# Altium project PCB_Project803.PrjPcb (part 2 of 2)

## Sheet Cpu.SchDoc
size A4; SheetNumber: 7; SheetTotal: 7
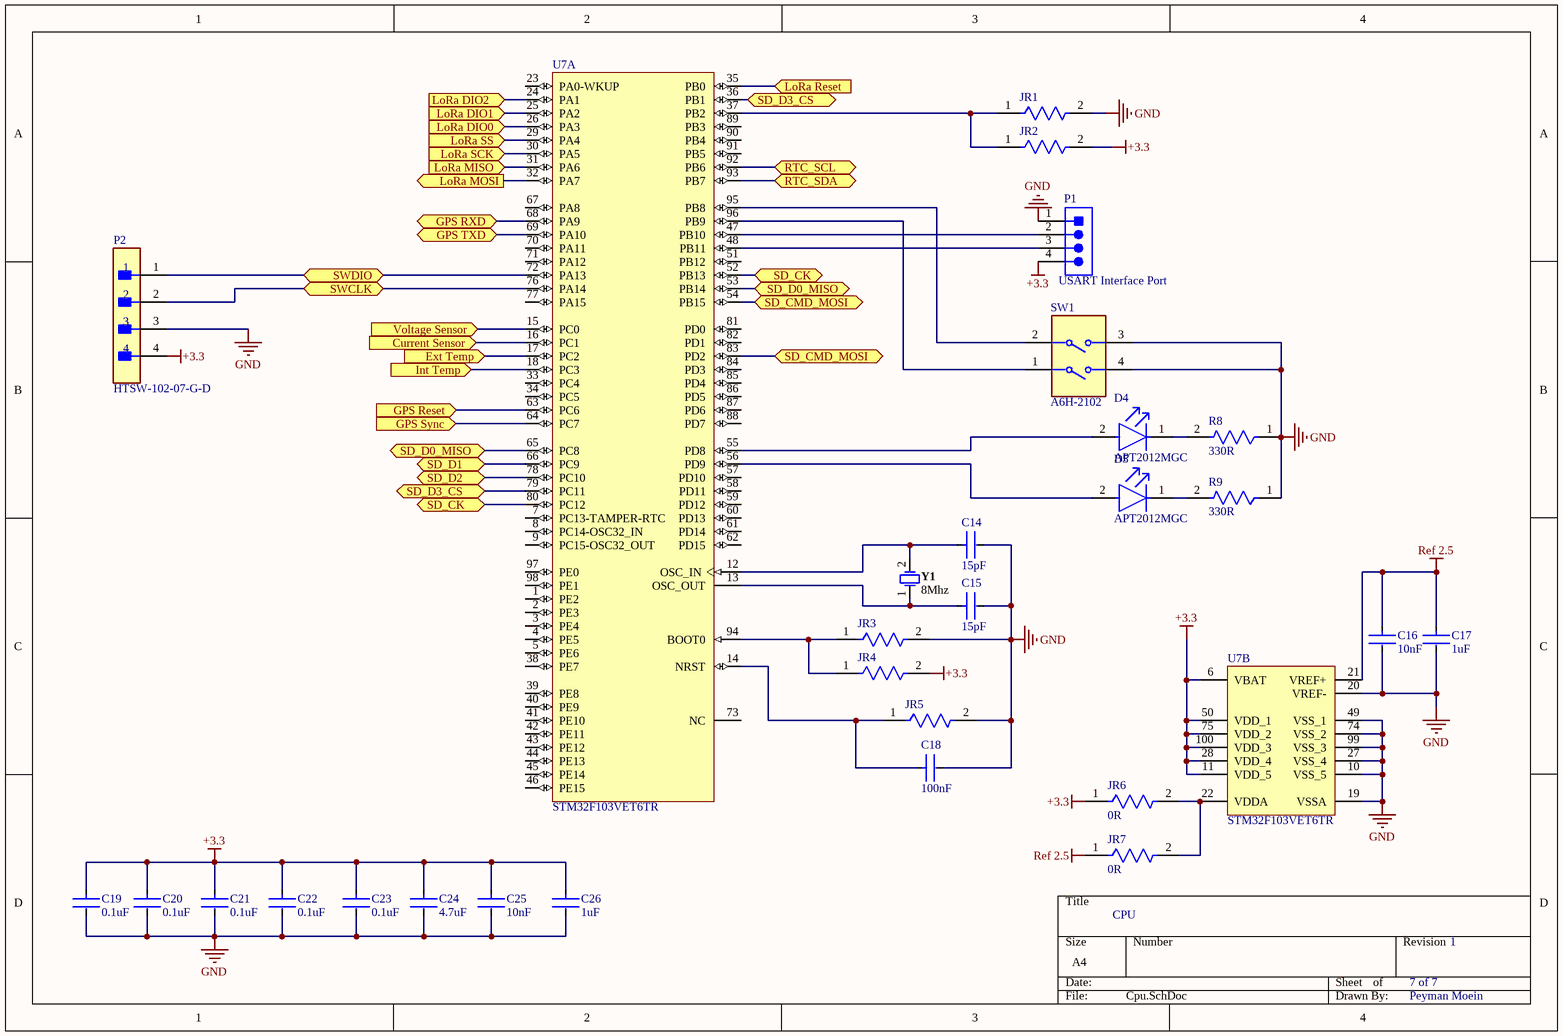
[diagram p6: Cpu.SchDoc]

### Parts
C14  15pF  [FP-C0805C-DN-MFG]
C15  15pF  [FP-C0805C-DN-MFG]
C16  10nF  [FP-C0805C-DN-MFG]
C17  1uF  [FP-C0805C-DN-MFG]
C18  100nF  [FP-C0805C-DN-MFG]
C19  0.1uF  [FP-C0805C-DN-MFG]
C20  0.1uF  [FP-C0805C-DN-MFG]
C21  0.1uF  [FP-C0805C-DN-MFG]
C22  0.1uF  [FP-C0805C-DN-MFG]
C23  0.1uF  [FP-C0805C-DN-MFG]
C24  4.7uF  [FP-C0805C-DN-MFG]
C25  10nF  [FP-C0805C-DN-MFG]
C26  1uF  [FP-C0805C-DN-MFG]
D4  APT2012MGC  [FP-APT2012MGC-MFG]
D5  APT2012MGC  [FP-APT2012MGC-MFG]
JR1  0R  [FP-RMCF0805-MFG]  (value not drawn)
JR2  0R  [FP-RMCF0805-MFG]  (value not drawn)
JR3  0R  [FP-RMCF0805-MFG]  (value not drawn)
JR4  0R  [FP-RMCF0805-MFG]  (value not drawn)
JR5  NC  [FP-RMCF0805-MFG]  (value not drawn)
JR6  0R  [FP-RMCF0805-MFG]
JR7  0R  [FP-RMCF0805-MFG]
P1  USART Interface Port  [JST-S4B-XH-A(LF)(SN)_V]
P2  HTSW-102-07-G-D  [FP-HTSW-102-07-G-D-MFG]
R8  330R  [FP-CRCW0805-e3-MFG]
R9  330R  [FP-CRCW0805-e3-MFG]
SW1  A6H-2102  [FP-A6H-2102-MFG]
U7  STM32F103VET6TR  [STM-LQFP100_L]  (parts A,B of 2)
Y1  8Mhz  [FOX-FOXSLF080-20]

### Ports
Current Sensor (in), Ext Temp (in), GPS Reset (in), GPS RXD (bidir), GPS Sync (in), GPS TXD (bidir), Int Temp (in), LoRa DIO0 (in), LoRa DIO1 (in), LoRa DIO2 (in), LoRa MISO (in), LoRa MOSI (out), LoRa Reset (in), LoRa SCK (in), LoRa SS (in), RTC_SCL (bidir), RTC_SDA (bidir), SD_CK (bidir), SD_CMD_MOSI (bidir), SD_D0_MISO (bidir), SD_D1 (bidir), SD_D2 (bidir), SD_D3_CS (bidir), SWCLK (bidir), SWDIO (bidir), Voltage Sensor (in)

### Nets
+3.3: C19.1 C20.1 C21.1 C22.1 C23.1 C24.1 C25.1 C26.1 JR2.2 JR4.2 JR6.1 P1.4 P2.4 U7.6(VBAT) U7.11(VDD_5) U7.28(VDD_4) U7.50(VDD_1) U7.75(VDD_2) U7.100(VDD_3)
GND: C14.2 C15.2 C16.2 C17.2 C18.2 C19.2 C20.2 C21.2 C22.2 C23.2 C24.2 C25.2 C26.2 JR1.2 JR3.2 JR5.2 P1.1 P2.3 R8.1 R9.1 SW1.3 SW1.4 U7.10(VSS_5) U7.19(VSSA) U7.20(VREF-) U7.27(VSS_4) U7.49(VSS_1) U7.74(VSS_2) U7.99(VSS_3)
Ref 2.5: C16.1 C17.1 JR7.1 U7.21(VREF+)
NetC10_2: U7.16(PC1) ; port Current Sensor
NetC14_1: C14.1 U7.12(OSC_IN) Y1.2
NetC15_1: C15.1 U7.13(OSC_OUT) Y1.1
NetC18_1: C18.1 JR5.1 U7.14(NRST)
NetD4_1: D4.1(C) R8.2
NetD4_2: D4.2(A) U7.55(PD8)
NetD5_1: D5.1(C) R9.2
NetD5_2: D5.2(A) U7.56(PD9)
NetJR1_1: JR1.1 JR2.1 U7.37(PB2)
NetJR3_1: JR3.1 JR4.1 U7.94(BOOT0)
NetJR6_2: JR6.2 JR7.2 U7.22(VDDA)
NetMD1_2: U7.31(PA6) ; port LoRa MISO
NetMD1_3: U7.32(PA7) ; port LoRa MOSI
NetMD1_4: U7.30(PA5) ; port LoRa SCK
NetMD1_5: U7.29(PA4) ; port LoRa SS
NetMD1_6: U7.35(PB0) ; port LoRa Reset
NetMD1_14: U7.26(PA3) ; port LoRa DIO0
NetMD1_15: U7.25(PA2) ; port LoRa DIO1
NetMD1_16: U7.24(PA1) ; port LoRa DIO2
NetP1_2: P1.2 U7.47(PB10)
NetP1_3: P1.3 U7.48(PB11)
NetP2_1: P2.1 U7.72(PA13) ; port SWDIO
NetP2_2: P2.2 U7.76(PA14) ; port SWCLK
NetP_Temp_3: U7.17(PC2) ; port Ext Temp
NetR11_1: U7.92(PB6) ; port RTC_SCL
NetR12_1: U7.93(PB7) ; port RTC_SDA
NetR13_2: U7.78(PC10) ; port SD_D2
NetR14_2: U7.36(PB1) U7.79(PC11) ; port SD_D3_CS
NetR15_2: U7.54(PB15) U7.83(PD2) ; port SD_CMD_MOSI
NetR16_2: U7.52(PB13) U7.80(PC12) ; port SD_CK
NetR17_2: U7.53(PB14) U7.65(PC8) ; port SD_D0_MISO
NetR18_2: U7.66(PC9) ; port SD_D1
NetSW1_1: SW1.1 U7.96(PB9)
NetSW1_2: SW1.2 U7.95(PB8)
NetU4_6: U7.15(PC0) ; port Voltage Sensor
NetU6_2: U7.18(PC3) ; port Int Temp
NetU7_63: U7.63(PC6) ; port GPS Reset
NetU7_64: U7.64(PC7) ; port GPS Sync
NetU7_68: U7.68(PA9) ; port GPS RXD
NetU7_69: U7.69(PA10) ; port GPS TXD

Not connected (* = marked no-connect by the designer): U7 1(PE2) 2(PE3) 3(PE4) 4(PE5) 5(PE6) 7(PC13-TAMPER-RTC) 8(PC14-OSC32_IN) 9(PC15-OSC32_OUT) 23(PA0-WKUP) 33(PC4) 34(PC5) 38(PE7) 39(PE8) 40(PE9) 41(PE10) 42(PE11) 43(PE12) 44(PE13) 45(PE14) 46(PE15) 51(PB12) 57(PD10) 58(PD11) 59(PD12) 60(PD13) 61(PD14) 62(PD15) 67(PA8) 70(PA11) 71(PA12) 73(NC) 77(PA15) 81(PD0) 82(PD1) 84(PD3) 85(PD4) 86(PD5) 87(PD6) 88(PD7) 89(PB3) 90(PB4) 91(PB5) 97(PE0) 98(PE1)

### Notes on the sheet
- CPU
- 7 of 7
- 1
- Peyman Moein

### Library data of the parts
C14 C15 = CMP-2007-00279-2: C396747; Manufacturer Part Number: C0805C104K5RACTU; Manufacturer: KEMET; Voltage Rating: 50 V; Value: 0.10 μF; Tolerance: 0.1; Temperature Characteristic: X7R; Temperature Coefficient: 30ppm/°C; Material: Ceramic; Device Class L2: Capacitors; Temperature Range Low: -55°C; Digikey Description: CAP CER 0.1UF 50V X7R 0805; Category: Cap; ComponentLink2Description: Datasheet; Octopart: https://octopart.com/c0805c104k5ractu-kemet-143926; RoHS: TRUE; ComponentLink2URL: https://content.kemet.com/datasheets/KEM_C1003_C0G_SMD.pdf; Temperature: -55°C to +125°C; Height: 0.88mm; Temperature Range High: +125°C; Device Class L1: Passive Components; Automotive: No; Lead Free: Yes; Ipc Land Pattern Name: CAPC200125X78; Device Class L3: Ceramic Capacitors; Mouser Description: Cap Ceramic 0.1uF 50V X7R 10% SMD 2.0 x 1.2 mm 125 C Paper T/R; Capacitance: 0.10 μF; Package: C0805C-DN
C16 C25 = CMP-2007-00279-2: C188188; Manufacturer Part Number: C0805C104K5RACTU; Manufacturer: KEMET; Voltage Rating: 50 V; Value: 0.10 μF; Tolerance: 0.1; Temperature Characteristic: X7R; Temperature Coefficient: 30ppm/°C; Material: Ceramic; Device Class L2: Capacitors; Temperature Range Low: -55°C; Digikey Description: CAP CER 0.1UF 50V X7R 0805; Category: Cap; ComponentLink2Description: Datasheet; Octopart: https://octopart.com/c0805c104k5ractu-kemet-143926; RoHS: TRUE; ComponentLink2URL: https://content.kemet.com/datasheets/KEM_C1003_C0G_SMD.pdf; Temperature: -55°C to +125°C; Height: 0.88mm; Temperature Range High: +125°C; Device Class L1: Passive Components; Automotive: No; Lead Free: Yes; Ipc Land Pattern Name: CAPC200125X78; Device Class L3: Ceramic Capacitors; Mouser Description: Cap Ceramic 0.1uF 50V X7R 10% SMD 2.0 x 1.2 mm 125 C Paper T/R; Capacitance: 0.10 μF; Package: C0805C-DN
C17 C26 = CMP-2007-00279-2: C89190; Manufacturer Part Number: C0805C104K5RACTU; Manufacturer: KEMET; Voltage Rating: 50 V; Value: 0.10 μF; Tolerance: 0.1; Temperature Characteristic: X7R; Temperature Coefficient: 30ppm/°C; Material: Ceramic; Device Class L2: Capacitors; Temperature Range Low: -55°C; Digikey Description: CAP CER 0.1UF 50V X7R 0805; Category: Cap; ComponentLink2Description: Datasheet; Octopart: https://octopart.com/c0805c104k5ractu-kemet-143926; RoHS: TRUE; ComponentLink2URL: https://content.kemet.com/datasheets/KEM_C1003_C0G_SMD.pdf; Temperature: -55°C to +125°C; Height: 0.88mm; Temperature Range High: +125°C; Device Class L1: Passive Components; Automotive: No; Lead Free: Yes; Ipc Land Pattern Name: CAPC200125X78; Device Class L3: Ceramic Capacitors; Mouser Description: Cap Ceramic 0.1uF 50V X7R 10% SMD 2.0 x 1.2 mm 125 C Paper T/R; Capacitance: 0.10 μF; Package: C0805C-DN
C18-C23 = CMP-2007-00279-2: C49678; Manufacturer Part Number: C0805C104K5RACTU; Manufacturer: KEMET; Voltage Rating: 50 V; Value: 0.10 μF; Tolerance: 0.1; Temperature Characteristic: X7R; Temperature Coefficient: 30ppm/°C; Material: Ceramic; Device Class L2: Capacitors; Temperature Range Low: -55°C; Digikey Description: CAP CER 0.1UF 50V X7R 0805; Category: Cap; ComponentLink2Description: Datasheet; Octopart: https://octopart.com/c0805c104k5ractu-kemet-143926; RoHS: TRUE; ComponentLink2URL: https://content.kemet.com/datasheets/KEM_C1003_C0G_SMD.pdf; Temperature: -55°C to +125°C; Height: 0.88mm; Temperature Range High: +125°C; Device Class L1: Passive Components; Automotive: No; Lead Free: Yes; Ipc Land Pattern Name: CAPC200125X78; Device Class L3: Ceramic Capacitors; Mouser Description: Cap Ceramic 0.1uF 50V X7R 10% SMD 2.0 x 1.2 mm 125 C Paper T/R; Capacitance: 0.10 μF; Package: C0805C-DN
C24 = CMP-2007-00279-2: C215908; Manufacturer Part Number: C0805C104K5RACTU; Manufacturer: KEMET; Voltage Rating: 50 V; Value: 0.10 μF; Tolerance: 0.1; Temperature Characteristic: X7R; Temperature Coefficient: 30ppm/°C; Material: Ceramic; Device Class L2: Capacitors; Temperature Range Low: -55°C; Digikey Description: CAP CER 0.1UF 50V X7R 0805; Category: Cap; ComponentLink2Description: Datasheet; Octopart: https://octopart.com/c0805c104k5ractu-kemet-143926; RoHS: TRUE; ComponentLink2URL: https://content.kemet.com/datasheets/KEM_C1003_C0G_SMD.pdf; Temperature: -55°C to +125°C; Height: 0.88mm; Temperature Range High: +125°C; Device Class L1: Passive Components; Automotive: No; Lead Free: Yes; Ipc Land Pattern Name: CAPC200125X78; Device Class L3: Ceramic Capacitors; Mouser Description: Cap Ceramic 0.1uF 50V X7R 10% SMD 2.0 x 1.2 mm 125 C Paper T/R; Capacitance: 0.10 μF; Package: C0805C-DN
D4 D5 = CMP-1426-00010-2: C434432; Forward Voltage: 1.9V; Luminous Intensity: 60mcd; Dominant Wavelength: 630nm; Forward Current: 30mA; Viewing Angle: 140°; Lens Color: Colorless; Lens Style: Clear; Test Current: 20mA; Color: Red; Lens Size: 1.25mm; Packaging: Cut Tape; Width: 1.25mm; Case Code (Metric): 2012; Max Operating Temperature: 85°C; RoHS Compliant: Yes; Mount: Surface Mount; Case/Package: 0805; Series: WL-SMCW; Length: 2mm; Case Code (Imperial): 0805; Wavelength: 630nm; Min Operating Temperature: -40°C; Lens Transparency: Clear; Package Quantity: 1; Height: 0.8mm
JR1 JR4-JR6 = CMP-26527-000017-1: RES 0 OHM JUMPER 1/8W 0805; Power Rating: 125mW; Resistance: 0mR; Depth: 1.25mm; Length: 2mm; Military Standard: Not; Width: 0.049inch; Case Code (Imperial): 0805; Number of Terminations: 2; Mount: Surface Mount; Contact Plating: Tin; Height: 0.026inch; Case/Package: 0805; Min Operating Temperature: -55°C; Composition: Thick Film; Max Operating Temperature: 155°C; Packaging: Tape and Reel; Features: Automotive AEC-Q200; Max Power Dissipation: 125mW; Radiation Hardening: No; Lead Free: Lead Free; Case Code (Metric): 2012
JR2 = CMP-26527-000017-1: Power Rating: 125mW; Resistance: 0mR; Depth: 1.25mm; Length: 2mm; Military Standard: Not; Width: 0.049inch; Case Code (Imperial): 0805; Number of Terminations: 2; Mount: Surface Mount; Contact Plating: Tin; Height: 0.026inch; Case/Package: 0805; Min Operating Temperature: -55°C; Composition: Thick Film; Max Operating Temperature: 155°C; Packaging: Tape and Reel; Features: Automotive AEC-Q200; Max Power Dissipation: 125mW; Radiation Hardening: No; Lead Free: Lead Free; Case Code (Metric): 2012
JR3 JR7 = CMP-26527-000017-1: C25275; Power Rating: 125mW; Resistance: 0mR; Depth: 1.25mm; Length: 2mm; Military Standard: Not; Width: 0.049inch; Case Code (Imperial): 0805; Number of Terminations: 2; Mount: Surface Mount; Contact Plating: Tin; Height: 0.026inch; Case/Package: 0805; Min Operating Temperature: -55°C; Composition: Thick Film; Max Operating Temperature: 155°C; Packaging: Tape and Reel; Features: Automotive AEC-Q200; Max Power Dissipation: 125mW; Radiation Hardening: No; Lead Free: Lead Free; Case Code (Metric): 2012
P1 = CMP-1755-00007-1: C157925; PackageReference: S4B-XH-A(LF)(SN); ComponentLink1Description: Manufacturer URL; DatasheetVersion: May-16; ComponentLink2Description: Datasheet; ComponentLink2URL: http://www.jst-mfg.com/product/pdf/eng/eXH.pdf; ComponentLink1URL: http://www.jst.com/home2.html; PackageDescription: Male Header, Pitch 2.5 mm, 1 x 4 Position, Height 6.1 mm, Tail Length 3.4 mm
P2 = CMP-02766-000010-1: C66690; Manufacturer: Samtec; Voltage Rating: 550V; Conn Orientation: Straight; Pitch: 2.54mm; Number Of Contacts: 4; Conn Gender: Male; Current Rating: 6.3A; Number Of Rows: 2; Category: Conn; Temperature: -55°C to +125°C; Automotive: No; Digikey Description: CONN HEADER VERT 4POS 2.54MM; ComponentLink2URL: http://suddendocs.samtec.com/catalog_english/htsw_th.pdf; Device Class L2: Headers and Wire Housings; Mouser Description: Conn Unshrouded Header HDR 4 POS 2.54mm Solder ST Thru-Hole Bag; Manufacturer Part Number: HTSW-102-07-G-D; Temperature Range High: +125°C; Contact Material: Gold,Nickel; Temperature Range Low: -55°C; ComponentLink2Description: Datasheet; Device Class L1: Connectors; Octopart: https://octopart.com/htsw-102-07-g-d-samtec-10531767; RoHS: TRUE; Package: HTSW-102-07-G-D; Lead Free: Yes; Device Class L3: unset; Height: 8.71mm
R8 R9 = CMP-02407-004193-1: C17630; Tolerance: 1%; Resistance: 2.94R; Max Power Dissipation: 125mW; Temperature Coefficient: 100ppm/°C; Voltage Rating: 150V; Case/Package: 0805; Radiation Hardening: No; Width: 0.049inch; Packaging: Tape and Reel; Height: 0.02inch; Case Code (Imperial): 0805; Length: 2mm; Termination: SMD/SMT; Lead Free: Lead Free; Weight: 0.000194oz; Features: Automotive AEC-Q200; Min Operating Temperature: -55°C; Case Code (Metric): 2012; Contact Plating: Tin; Composition: Thick Film; Military Standard: Not; Number of Terminations: 2; Depth: 1.25mm; Package Quantity: 10; Max Operating Temperature: 155°C; Power Rating: 125mW
SW1 = CMP-08827-000068-1: SWITCH SLIDE DIP SPST 25MA 24V; Washable: Yes; Number of Circuits: 2; Actuator Type: Slide (Standard); Contact Resistance: 200mR; Pitch: 0.05inch; Mechanical Life: 1000Cycles; Actuator Length: 0mm; Number of Poles: 8; Weight: 0.06g; Orientation: Straight; Case/Package: DIP; Contact Current Rating: 25mA; Termination: Gull Wing; Package Quantity: 75; Series: A6H; Number of Positions: 2; Current Rating: 25mA; Throw Configuration: SPST; Height: 1.55mm; Max Current Rating: 25mA; Length: 0.148inch; RoHS Compliant: Yes; Voltage Rating (DC): 24V; Mount: Surface Mount; Max Voltage Rating (DC): 24V; Max Operating Temperature: 70°C; Terminal Pitch: 1.27mm; Packaging: Rail/Tube; Electrical Life: 1000Cycles; Min Operating Temperature: -20°C; Width: 4.5mm
U7 = CMP-0237-00166-3: C8308; Packing: Tape and Reel; Core: ARM Cortex-M3; D/A Converter: 2x12-bit (2 Channel); I/Os (High Current): 80; Internal RAM Size (kB): 64; FLASH Size (Prog) (kB): 512; Supply Voltage(Vcc) min (V): 2; A/D Converter: 3x12-bit (16 Channel); Operating Frequency(F) (Processor speed) (MHz): 72; DatasheetVersion: Rev. 8; PackageDescription: 100-Pin Low Profile Quad Flat Package, 14 x 14 mm Body, 0.5 mm Pitch; PartNumber: STM32F103VET6TR; PackageVersion: Rev. 1, 06/2013; ComponentLink2Description: Datasheet; ComponentLink2URL: http://www.st.com/st-web-ui/static/active/en/resource/technical/document/datasheet/CD00191185.pdf; Mounting Technology: Surface Mount; ComponentLink1Description: Manufacturer URL; PackageReference: LQFP100; ComponentLink3Description: Package Specification; ComponentLink3URL: http://www.st.com/st-web-ui/static/active/en/resource/technical/document/data_brief/DM00071938.pdf; ComponentLink1URL: http://www.st.com/web/en/home.html
Y1 = CMP-1749-00002-1: C111806; Dropout Voltage: 2 V; Outputs: 1; Nominal Output Voltage: 5 V; Min Input Voltage: 7 V; Case\Package: TO-263-3; Max Input Voltage: 35 V; Max Ouput Current: 1 A; Length: 10.24 mm; Max Operating Temperature: 125 degC; Mount: Surface Mount; PackageDescription: 2-Pin Through Hole Device, Body 11.35 x 4.65 mm; Package Quantity: 50; Pins: 3; ComponentLink2URL: http://download.siliconexpert.com/pdfs/2015/4/5/6/5/7/200/fox_/manual/35607121449963728hc49slf.pdf; PackageReference: FOXSLF080-20; Min Operating Temperature: 0 degC; Height: 30.02 mm; Packaging: Rail/Tube; Radiation Hardening: No; Width: 9.35 mm; ComponentLink1URL: http://www.foxonline.com/; DatasheetVersion: Mar-15; ComponentLink1Description: Manufacturer URL; Output Voltage: 5 V; RoHSCompliant: true; REACH SVHC: No SVHC; Output Current: 1 A; ComponentLink2Description: Datasheet

## Nets that join several sheets
+3.3: Power (C3.2 U2.2 U2.4), Sensors (U4.8), GPS (C30.1 C33.1 U8.4), LoRa (C31.1 C32.1 MD1.13), RealTime (R11.2 R12.2), SD (7 pins), Cpu (19 pins)
+5: Power (7 pins), Sensors (5 pins), RealTime (U9.8)
Bat Input 40V: Power (C1.2 D1.1 U1.1), Sensors (R6.2)
GND: Power (16 pins), Sensors (11 pins), GPS (11 pins), LoRa (8 pins), RealTime (BT1.2 U9.4), SD (5 pins), Cpu (29 pins)
Ref 2.5: Power (C5.2 C8.1 U3.6), Sensors (R2.2), Cpu (C16.1 C17.1 JR7.1 U7.21)
V_Bat: GPS (C29.1 U8.5), RealTime (BT1.1 U9.3)
NetC10_2: Sensors (C10.2 R3.1 U4.1), Cpu (U7.16)
NetMD1_2: LoRa (MD1.2), Cpu (U7.31)
NetMD1_3: LoRa (MD1.3), Cpu (U7.32)
NetMD1_4: LoRa (MD1.4), Cpu (U7.30)
NetMD1_5: LoRa (MD1.5), Cpu (U7.29)
NetMD1_6: LoRa (MD1.6), Cpu (U7.35)
NetMD1_14: LoRa (MD1.14), Cpu (U7.26)
NetMD1_15: LoRa (MD1.15), Cpu (U7.25)
NetMD1_16: LoRa (MD1.16), Cpu (U7.24)
NetP_Temp_3: Sensors (P_Temp.3), Cpu (U7.17)
NetR11_1: RealTime (R11.1 U9.6), Cpu (U7.92)
NetR12_1: RealTime (R12.1 U9.5), Cpu (U7.93)
NetR13_2: SD (R13.2 SD1.1), Cpu (U7.78)
NetR14_2: SD (R14.2 SD1.2), Cpu (U7.36 U7.79)
NetR15_2: SD (R15.2 SD1.3), Cpu (U7.54 U7.83)
NetR16_2: SD (R16.2 SD1.5), Cpu (U7.52 U7.80)
NetR17_2: SD (R17.2 SD1.7), Cpu (U7.53 U7.65)
NetR18_2: SD (R18.2 SD1.8), Cpu (U7.66)
NetU4_6: Sensors (U4.6 U4.7), Cpu (U7.15)
NetU6_2: Sensors (U6.2), Cpu (U7.18)
NetU7_63: GPS (U8.10), Cpu (U7.63)
NetU7_64: GPS (U8.6), Cpu (U7.64)
NetU7_68: GPS (U8.1), Cpu (U7.68)
NetU7_69: GPS (U8.2), Cpu (U7.69)